# EAGLE schematic ModulePlatform (EAGLE 7.7.0)

## Sheet 1 of 4
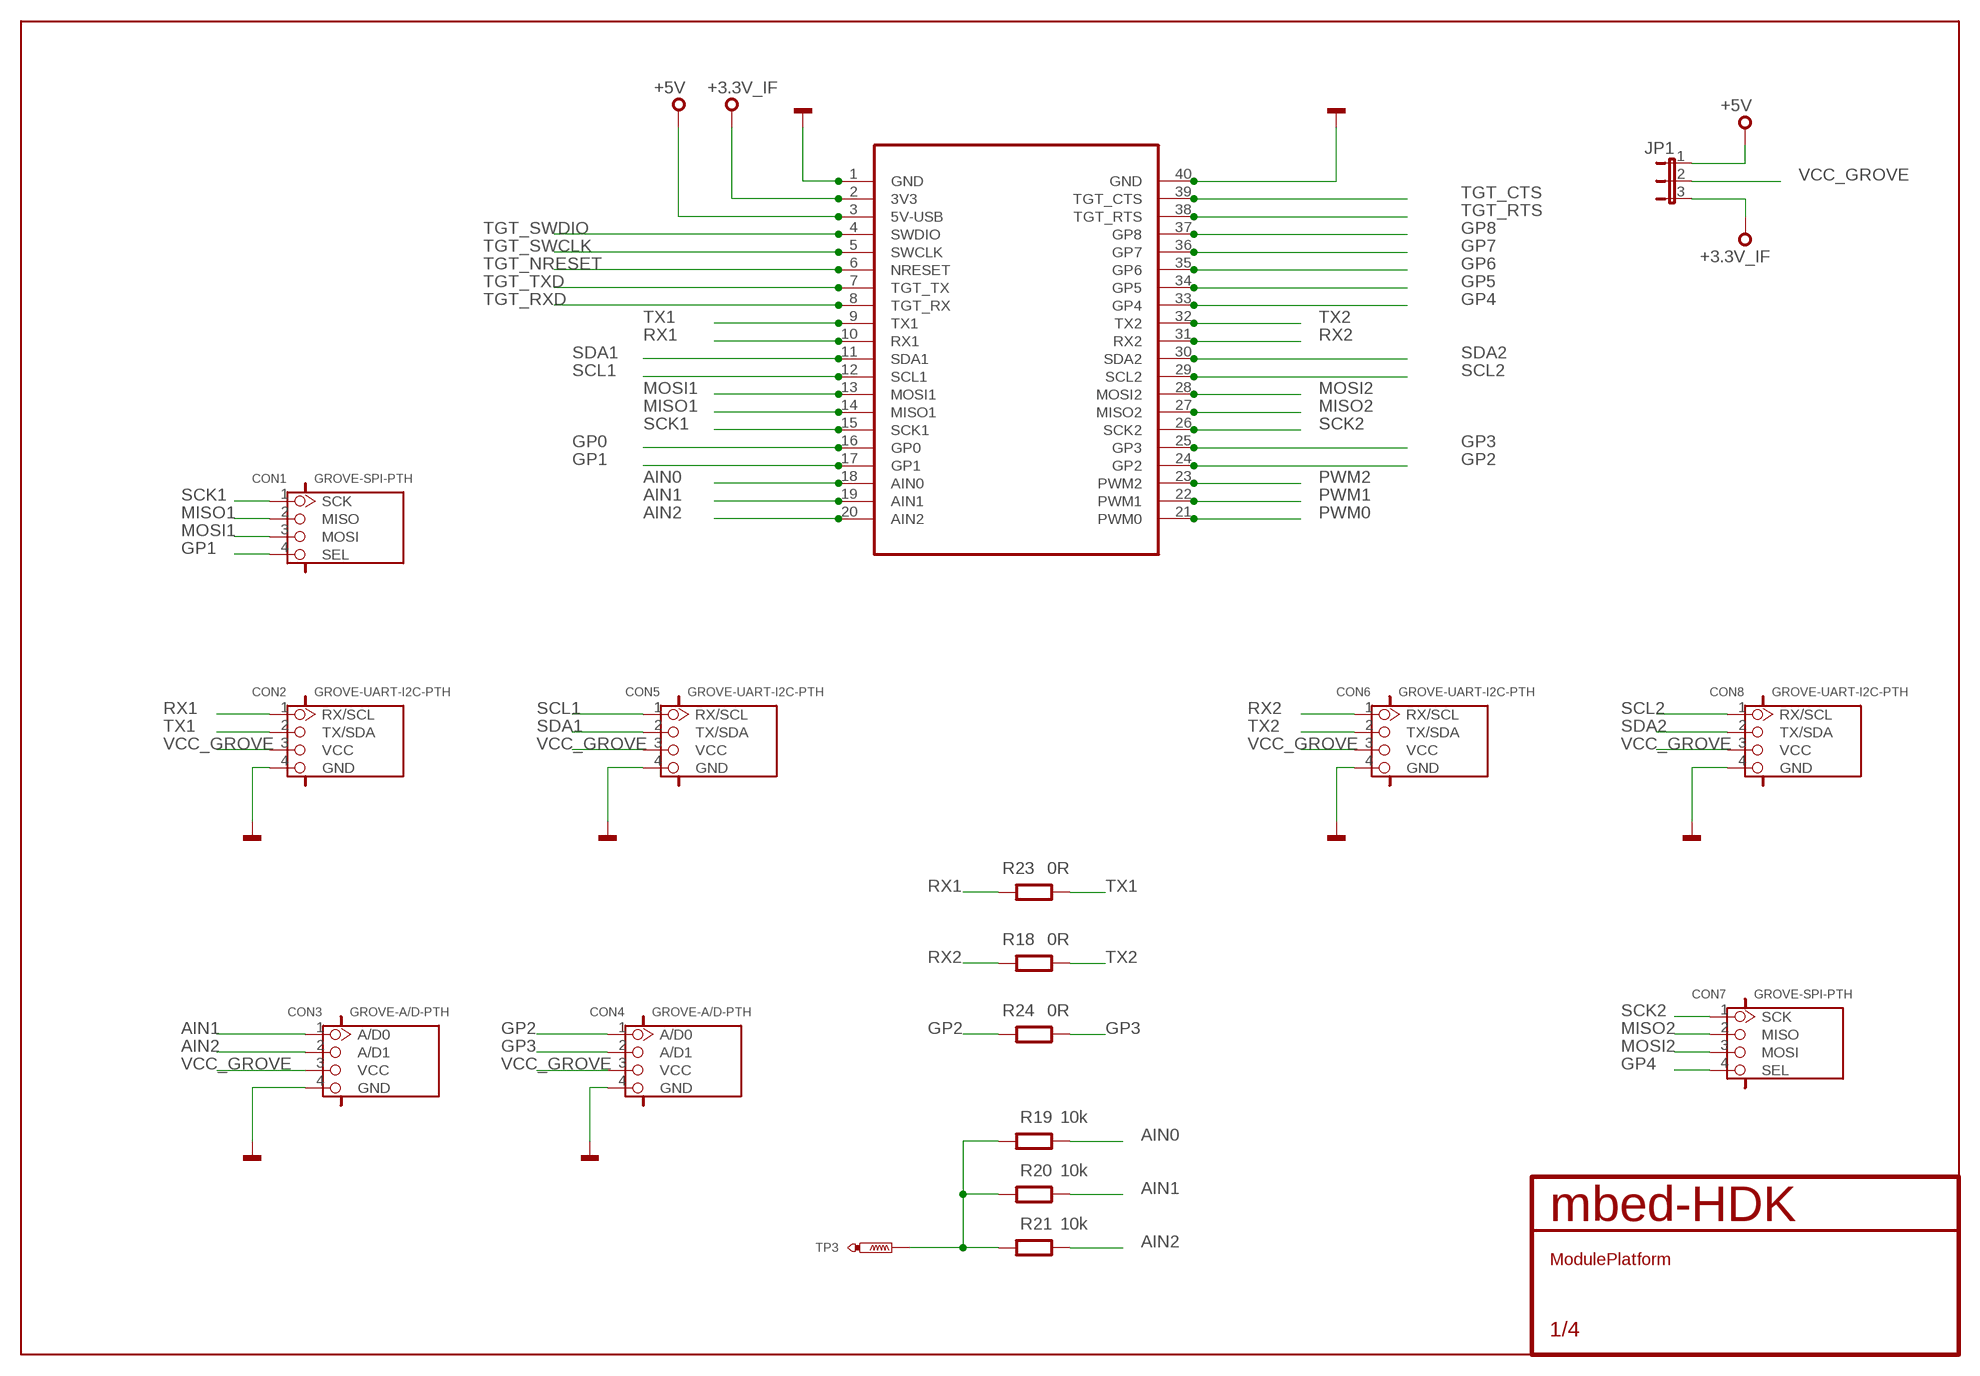
[diagram p0: schematic, sheet 1]

### Parts
CON1  GROVE-SPI-PTH  [HW4-2.0]
CON2  GROVE-UART-I2C-PTH  [HW4-2.0]
CON3  GROVE-A/D-PTH  [HW4-2.0]
CON4  GROVE-A/D-PTH  [HW4-2.0]
CON5  GROVE-UART-I2C-PTH  [HW4-2.0]
CON6  GROVE-UART-I2C-PTH  [HW4-2.0]
CON7  GROVE-SPI-PTH  [HW4-2.0]
CON8  GROVE-UART-I2C-PTH  [HW4-2.0]
JP1  JP2E  [JP2]
R18  0R  R0603  [0603@1]
R19  10k  R0603  [0603@1]
R20  10k  R0603  [0603@1]
R21  10k  R0603  [0603@1]
R23  0R  R0603  [0603@1]
R24  0R  R0603  [0603@1]
SKT1  MODULE_SOCKET  [MODULE_SOCKET]
TP3  TEST-POINT-50R-PTH  [TP50-PTH]

### Nets
+3.3V_IF: JP1.3 SKT1.2(3V3) SKT1.P$42 ; also sheet 2,3,4
+5V: JP1.1 SKT1.3(5V-USB) SKT1.P$43 ; also sheet 2
AIN0: R19.1 SKT1.18(AIN0) SKT1.P$58 ; also sheet 4
AIN1: CON3.1(A/D0) R20.1 SKT1.19(AIN1) SKT1.P$59
AIN2: CON3.2(A/D1) R21.1 SKT1.20(AIN2) SKT1.P$60
GND: CON2.4(GND) CON3.4(GND) CON4.4(GND) CON5.4(GND) CON6.4(GND) CON8.4(GND) SKT1.1(GND) SKT1.40(GND) SKT1.P$41 SKT1.P$80 ; also sheet 2,3,4
GP0: SKT1.16(GP0) SKT1.P$56 ; also sheet 4
GP1: CON1.4(SEL) SKT1.17(GP1) SKT1.P$57
GP2: CON4.1(A/D0) R24.2 SKT1.24(GP2) SKT1.P$64 ; also sheet 4
GP3: CON4.2(A/D1) R24.1 SKT1.25(GP3) SKT1.P$65
GP4: CON7.4(SEL) SKT1.33(GP4) SKT1.P$73
GP5: SKT1.34(GP5) SKT1.P$74 ; also sheet 4
GP6: SKT1.35(GP6) SKT1.P$75 ; also sheet 4
GP7: SKT1.36(GP7) SKT1.P$76 ; also sheet 4
GP8: SKT1.37(GP8) SKT1.P$77
MISO1: CON1.2(MISO) SKT1.14(MISO1) SKT1.P$54 ; also sheet 4
MISO2: CON7.2(MISO) SKT1.27(MISO2) SKT1.P$67
MOSI1: CON1.3(MOSI) SKT1.13(MOSI1) SKT1.P$53 ; also sheet 4
MOSI2: CON7.3(MOSI) SKT1.28(MOSI2) SKT1.P$68
N$24: R19.2 R20.2 R21.2 TP3.TP
PWM0: SKT1.21(PWM0) SKT1.P$61 ; also sheet 4
PWM1: SKT1.22(PWM1) SKT1.P$62 ; also sheet 4
PWM2: SKT1.23(PWM2) SKT1.P$63 ; also sheet 4
RX1: CON2.1(RX/SCL) R23.2 SKT1.10(RX1) SKT1.P$50
RX2: CON6.1(RX/SCL) R18.2 SKT1.31(RX2) SKT1.P$71
SCK1: CON1.1(SCK) SKT1.15(SCK1) SKT1.P$55 ; also sheet 4
SCK2: CON7.1(SCK) SKT1.26(SCK2) SKT1.P$66
SCL1: CON5.1(RX/SCL) SKT1.12(SCL1) SKT1.P$52 ; also sheet 4
SCL2: CON8.1(RX/SCL) SKT1.29(SCL2) SKT1.P$69 ; also sheet 4
SDA1: CON5.2(TX/SDA) SKT1.11(SDA1) SKT1.P$51 ; also sheet 4
SDA2: CON8.2(TX/SDA) SKT1.30(SDA2) SKT1.P$70 ; also sheet 4
TGT_CTS: SKT1.39(TGT_CTS) SKT1.P$79 ; also sheet 3
TGT_NRESET: SKT1.6(NRESET) SKT1.P$46 ; also sheet 3
TGT_RTS: SKT1.38(TGT_RTS) SKT1.P$78 ; also sheet 3
TGT_RXD: SKT1.8(TGT_RX) SKT1.P$48 ; also sheet 3
TGT_SWCLK: SKT1.5(SWCLK) SKT1.P$45 ; also sheet 3
TGT_SWDIO: SKT1.4(SWDIO) SKT1.P$44 ; also sheet 3
TGT_TXD: SKT1.7(TGT_TX) SKT1.P$47 ; also sheet 3
TX1: CON2.2(TX/SDA) R23.1 SKT1.9(TX1) SKT1.P$49
TX2: CON6.2(TX/SDA) R18.1 SKT1.32(TX2) SKT1.P$72
VCC_GROVE: CON2.3(VCC) CON3.3(VCC) CON4.3(VCC) CON5.3(VCC) CON6.3(VCC) CON8.3(VCC) JP1.2

## Sheet 2 of 4
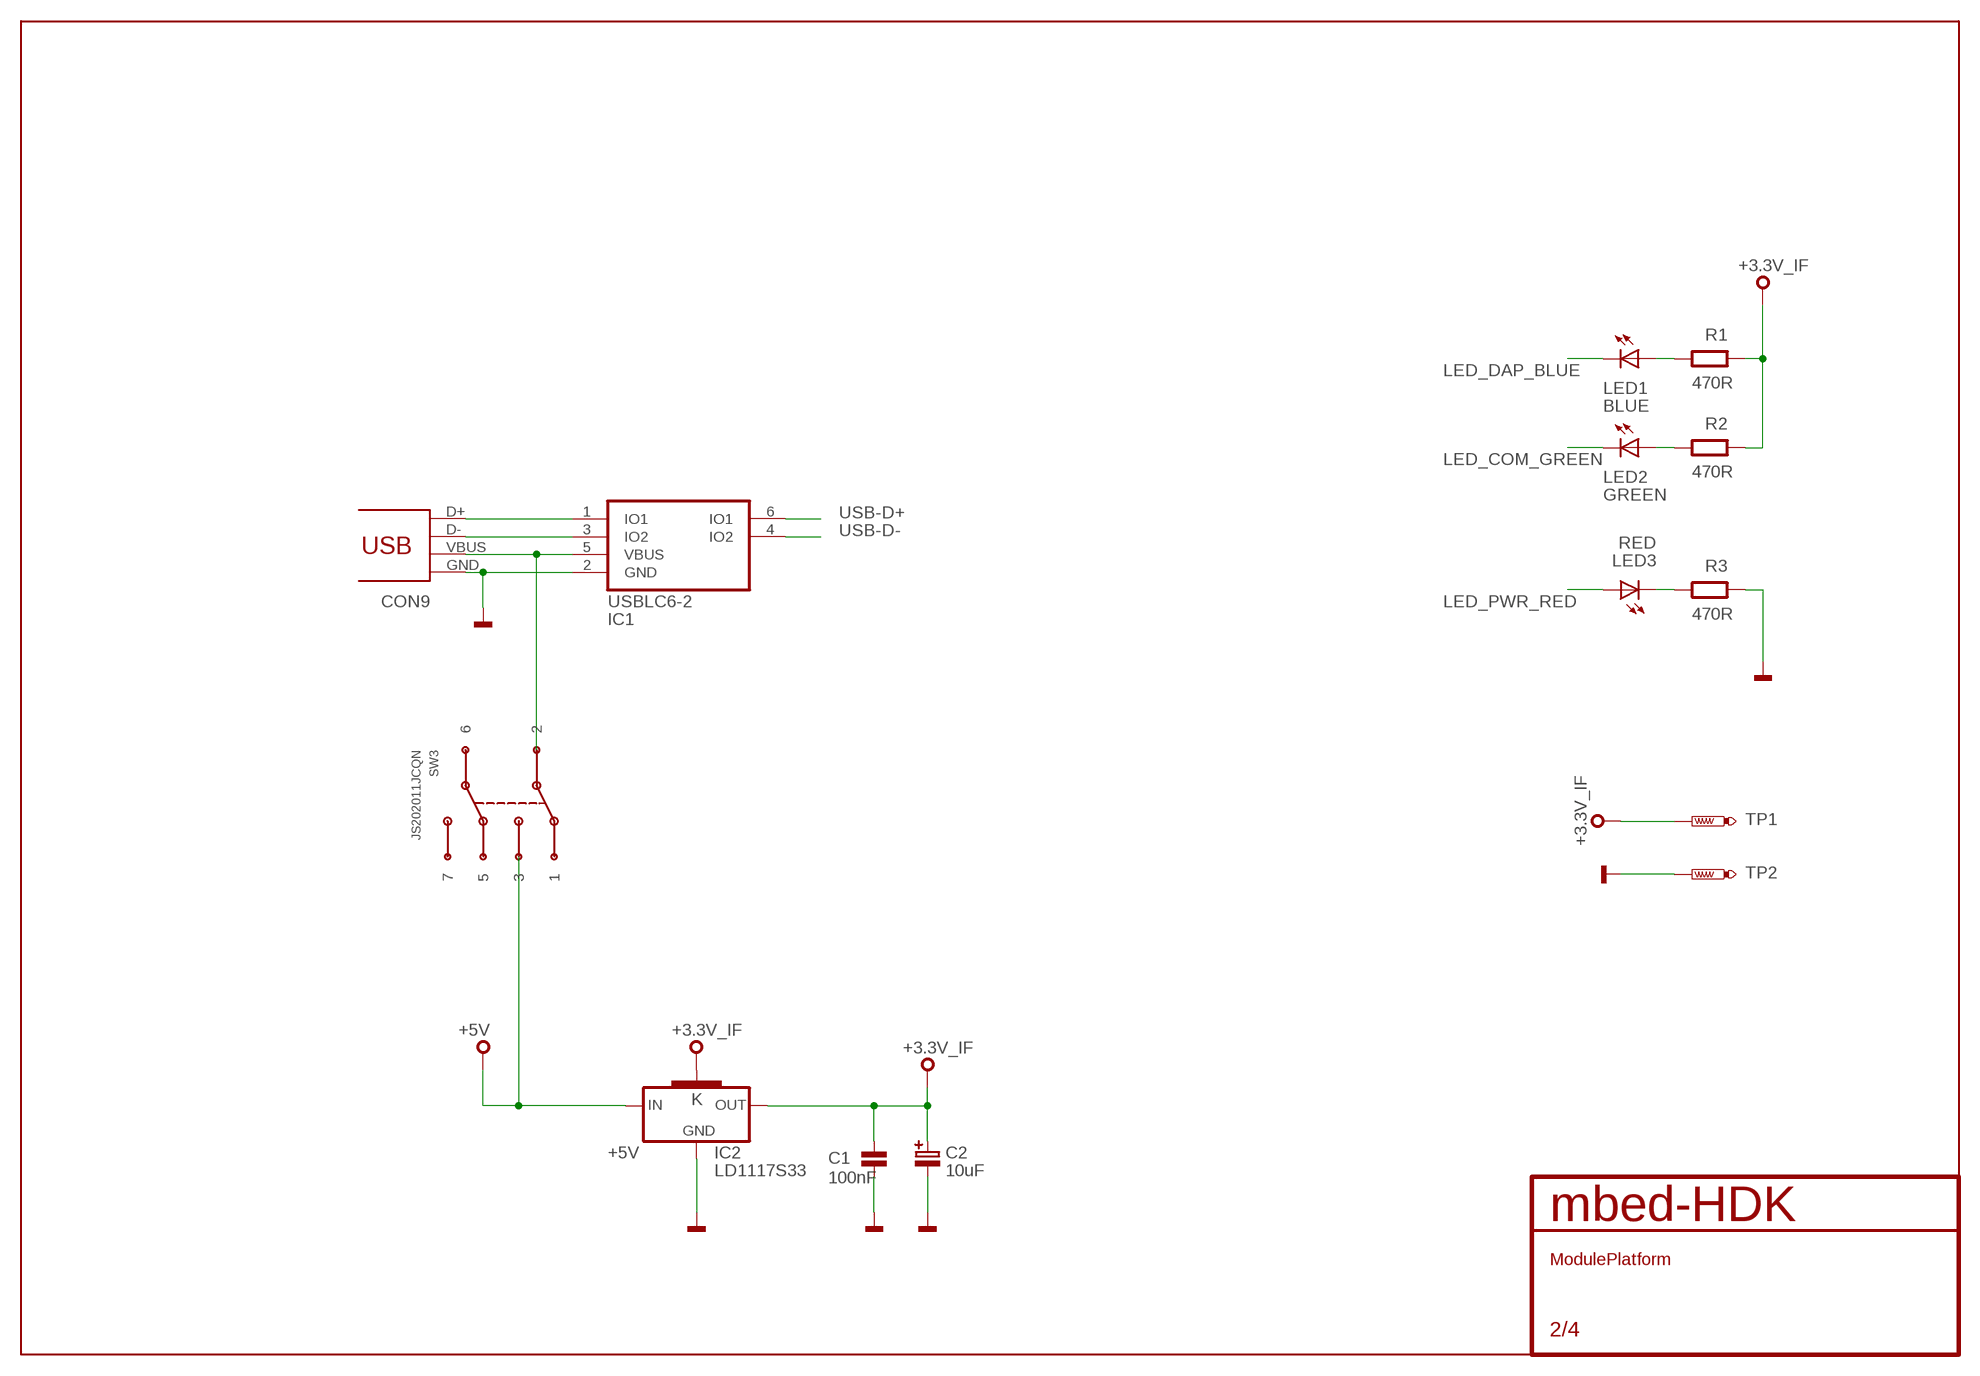
[diagram p1: schematic, sheet 2]

### Parts
C1  100nF  C0603  [0603]
C2  10uF  C-POLB  [SMC_B]
CON9  USB_MICROB  [MOLEX-47364-0001]
IC1  USBLC6-2SC6  [SOT23-6L]
IC2  LD1117S33  [SOT223]
LED1  BLUE  LED0603  [CHIPLED_0603]
LED2  GREEN  LED0603  [CHIPLED_0603]
LED3  RED  LED0603  [CHIPLED_0603]
R1  470R  R0603  [0603@1]
R2  470R  R0603  [0603@1]
R3  470R  R0603  [0603@1]
SW3  JS202011JCQN  [JS202011JCQN]
TP1  TEST-POINT-50R-PTH  [TP50-PTH]
TP2  TEST-POINT-50R-PTH  [TP50-PTH]

### Nets
+3.3V_IF: C1.1 C2.+ IC2.2(OUT) IC2.4(K) R1.1 R2.1 TP1.TP ; also sheet 1,3,4
+5V: IC2.3(IN) SW3.3 ; also sheet 1
GND: C1.2 C2.- CON9.GND IC1.2(GND) IC2.1(GND) R3.1 TP2.TP ; also sheet 1,3,4
LED_COM_GREEN: LED2.C ; also sheet 3
LED_DAP_BLUE: LED1.C ; also sheet 3
LED_PWR_RED: LED3.A ; also sheet 3
N$1: CON9.D+ IC1.1(IO1)
N$2: CON9.D- IC1.3(IO2)
N$6: LED2.A R2.2
N$9: LED3.C R3.2
N$13: LED1.A R1.2
N$27: CON9.VBUS IC1.5(VBUS) SW3.2
USB-D+: IC1.6(IO1) ; also sheet 3
USB-D-: IC1.4(IO2) ; also sheet 3
Unconnected: SW3.1 SW3.5 SW3.6 SW3.7

## Sheet 3 of 4
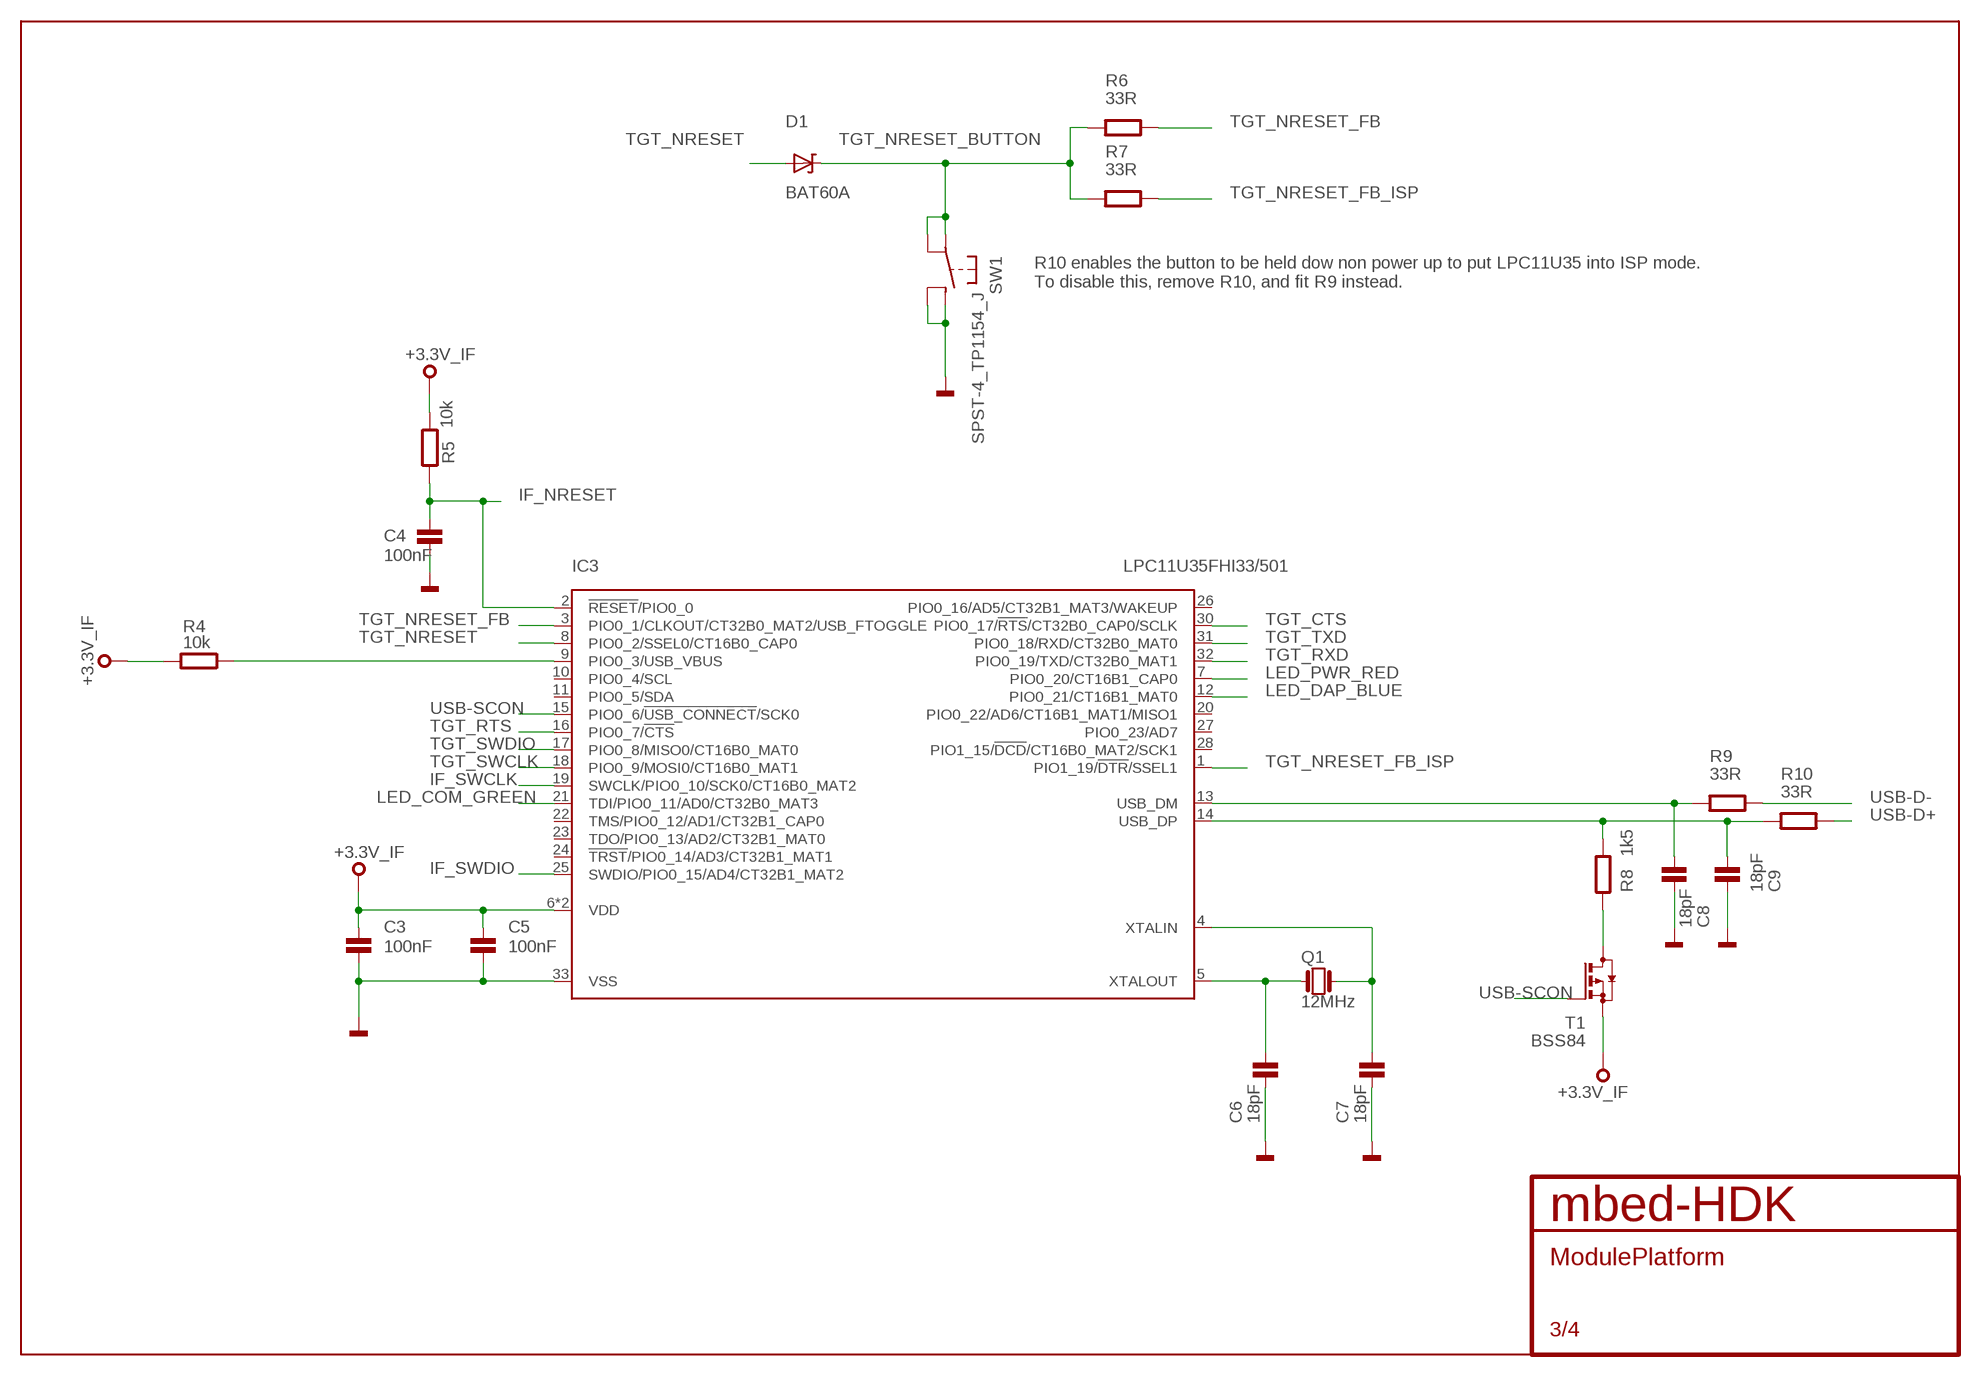
[diagram p2: schematic, sheet 3]

### Parts
C3  100nF  C0603  [0603]
C4  100nF  C0603  [0603]
C5  100nF  C0603  [0603]
C6  18pF  C0603  [0603]
C7  18pF  C0603  [0603]
C8  18pF  C0603  [0603]
C9  18pF  C0603  [0603]
D1  BAT60A  [BAT60A]
IC3  LPC11U35FHI33/501  [SOT617-3]
Q1  12MHz  Q_3.2X2.5  [3.2X.2.5]
R4  10k  R0603  [0603@1]
R5  10k  R0603  [0603@1]
R6  33R  R0603  [0603@1]
R7  33R  R0603  [0603@1]
R8  1k5  R0603  [0603@1]
R9  33R  R0603  [0603@1]
R10  33R  R0603  [0603@1]
SW1  SPST-4_TP1154_J  [TP-1154X]
T1  BSS84  [SOT23]

### Nets
+3.3V_IF: C3.1 C5.1 IC3.6(VDD) IC3.29(VDD) R4.2 R5.2 T1.2(S) ; also sheet 1,2,4
GND: C3.2 C4.2 C5.2 C6.2 C7.2 C8.2 C9.2 IC3.33(VSS) SW1.B1 SW1.B2 ; also sheet 1,2,4
IF_NRESET: C4.1 IC3.2(!RESET!/PIO0_0) R5.1
IF_SWCLK: IC3.19(SWCLK/PIO0_10/SCK0/CT16B0_MAT2)
IF_SWDIO: IC3.25(SWDIO/PIO0_15/AD4/CT32B1_MAT2)
LED_COM_GREEN: IC3.21(TDI/PIO0_11/AD0/CT32B0_MAT3) ; also sheet 2
LED_DAP_BLUE: IC3.12(PIO0_21/CT16B1_MAT0) ; also sheet 2
LED_PWR_RED: IC3.7(PIO0_20/CT16B1_CAP0) ; also sheet 2
N$7: IC3.9(PIO0_3/USB_VBUS) R4.1
N$10: C6.1 IC3.5(XTALOUT) Q1.P$1
N$14: C7.1 IC3.4(XTALIN) Q1.P$3
N$23: R8.1 T1.3(D)
TGT_CTS: IC3.30(PIO0_17/!RTS!/CT32B0_CAP0/SCLK) ; also sheet 1
TGT_NRESET: D1.A IC3.8(PIO0_2/SSEL0/CT16B0_CAP0) ; also sheet 1
TGT_NRESET_BUTTON: D1.K R6.2 R7.2 SW1.A1 SW1.A2
TGT_NRESET_FB: IC3.3(PIO0_1/CLKOUT/CT32B0_MAT2/USB_FTOGGLE) R6.1
TGT_NRESET_FB_ISP: IC3.1(PIO1_19/!DTR!/SSEL1) R7.1
TGT_RTS: IC3.16(PIO0_7/!CTS!) ; also sheet 1
TGT_RXD: IC3.32(PIO0_19/TXD/CT32B0_MAT1) ; also sheet 1
TGT_SWCLK: IC3.18(PIO0_9/MOSI0/CT16B0_MAT1) ; also sheet 1
TGT_SWDIO: IC3.17(PIO0_8/MISO0/CT16B0_MAT0) ; also sheet 1
TGT_TXD: IC3.31(PIO0_18/RXD/CT32B0_MAT0) ; also sheet 1
USB-D+: R10.1 ; also sheet 2
USB-D-: R9.1 ; also sheet 2
USB-SCON: IC3.15(PIO0_6/!USB_CONNECT!/SCK0) T1.1(G)
USB_DM: C8.1 IC3.13(USB_DM) R9.2
USB_DP: C9.1 IC3.14(USB_DP) R8.2 R10.2
Unconnected: IC3.10(PIO0_4/SCL) IC3.11(PIO0_5/SDA) IC3.20(PIO0_22/AD6/CT16B1_MAT1/MISO1) IC3.22(TMS/PIO0_12/AD1/CT32B1_CAP0) IC3.23(TDO/PIO0_13/AD2/CT32B1_MAT0) IC3.24(!TRST!/PIO0_14/AD3/CT32B1_MAT1) IC3.26(PIO0_16/AD5/CT32B1_MAT3/WAKEUP) IC3.27(PIO0_23/AD7) IC3.28(PIO1_15/!DCD!/CT16B0_MAT2/SCK1)

### Notes on the sheet
- R10 enables the button to be held dow non power up to put LPC11U35 into ISP mode.
  To disable this, remove R10, and fit R9 instead.

## Sheet 4 of 4
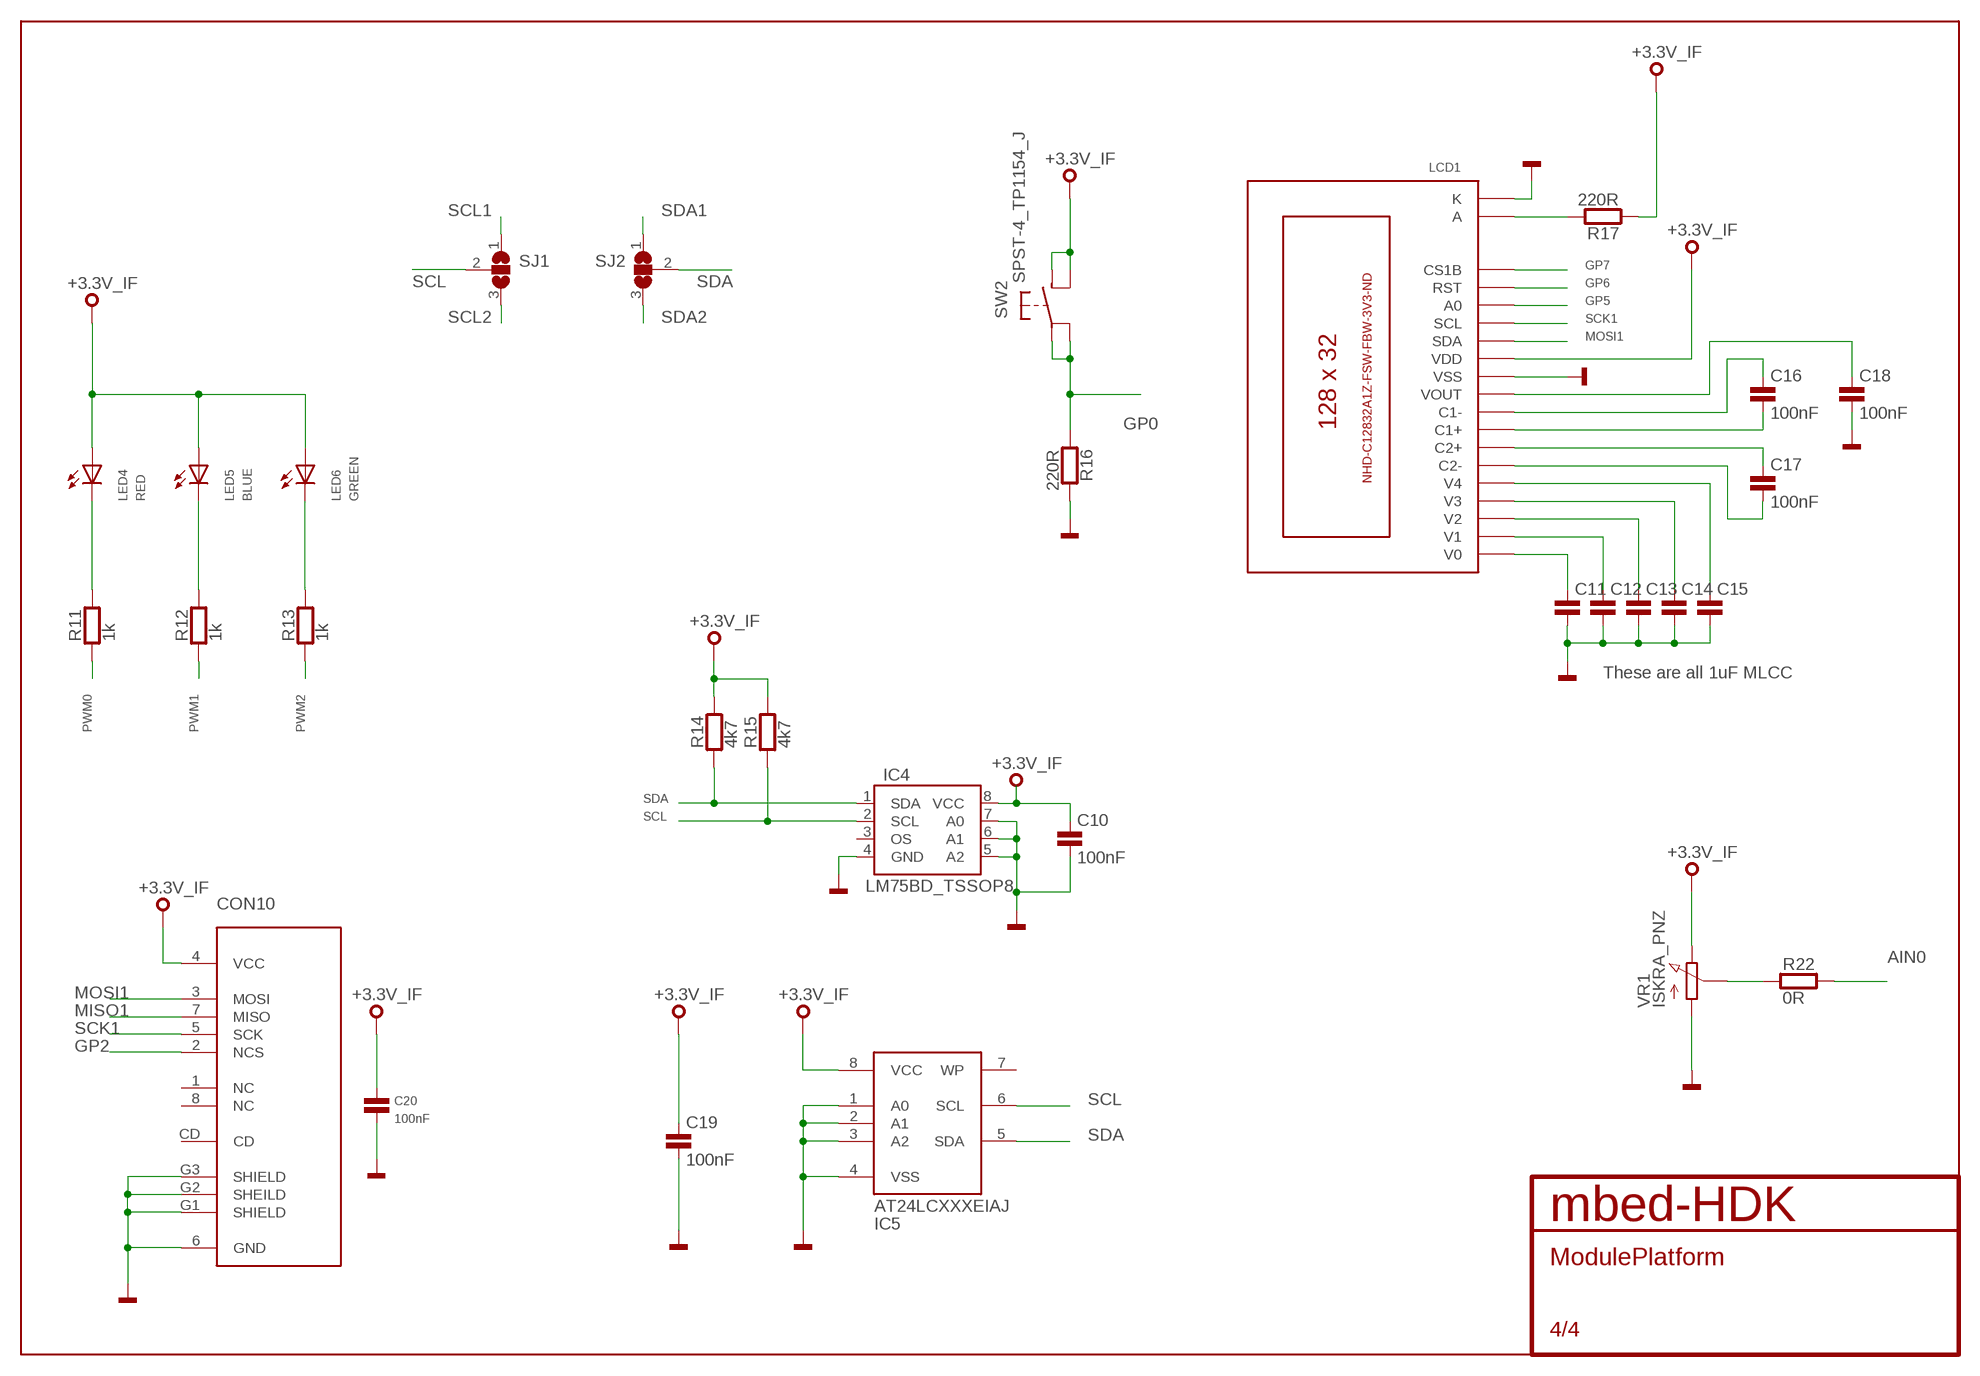
[diagram p3: schematic, sheet 4]

### Parts
C10  100nF  C0603  [0603]
C11  100nF  C0603  [0603]
C12  100nF  C0603  [0603]
C13  100nF  C0603  [0603]
C14  100nF  C0603  [0603]
C15  100nF  C0603  [0603]
C16  100nF  C0603  [0603]
C17  100nF  C0603  [0603]
C18  100nF  C0603  [0603]
C19  100nF  C0603  [0603]
C20  100nF  C0603  [0603]
CON10  MICRO-SD  [AMPHENOL-101-00660-68-6]
IC4  LM75BD_TSSOP8  [TSSOP8]
IC5  AT24LCXXXEIAJ  [SO08-EIAJ]
LCD1  C12832A1Z  [C12832A1Z]
LED4  RED  LED0603  [CHIPLED_0603]
LED5  BLUE  LED0603  [CHIPLED_0603]
LED6  GREEN  LED0603  [CHIPLED_0603]
R11  1k  R0603  [0603]
R12  1k  R0603  [0603]
R13  1k  R0603  [0603]
R14  4k7  R0603  [0603]
R15  4k7  R0603  [0603]
R16  220R  R0603  [0603]
R17  220R  R0603  [0603]
R22  0R  R0603  [0603]
SJ1  SJ2W  [SJ_2]
SJ2  SJ2W  [SJ_2]
SW2  SPST-4_TP1154_J  [TP-1154X]
VR1  ISKRA_PNZ  [CA14V]

### Nets
+3.3V_IF: C10.1 C19.1 C20.1 CON10.4(VCC) IC4.8(VCC) IC5.8(VCC) LCD1.P$12(VDD) LED4.A LED5.A LED6.A R14.2 R15.2 R17.1 SW2.B1 SW2.B2 VR1.P$3(E) ; also sheet 1,2,3
AIN0: R22.2 ; also sheet 1
GND: C10.2 C11.2 C12.2 C13.2 C14.2 C15.2 C18.2 C19.2 C20.2 CON10.6(GND) CON10.G1(SHIELD) CON10.G2(SHEILD) CON10.G3(SHIELD) IC4.4(GND) IC4.5(A2) IC4.6(A1) IC4.7(A0) IC5.1(A0) IC5.2(A1) IC5.3(A2) IC5.4(VSS) LCD1.K LCD1.P$11(VSS) R16.2 VR1.P$1(A) ; also sheet 1,2,3
GP0: R16.1 SW2.A1 SW2.A2 ; also sheet 1
GP2: CON10.2(NCS) ; also sheet 1
GP5: LCD1.P$15(A0) ; also sheet 1
GP6: LCD1.P$16(RST) ; also sheet 1
GP7: LCD1.P$17(CS1B) ; also sheet 1
MISO1: CON10.7(MISO) ; also sheet 1
MOSI1: CON10.3(MOSI) LCD1.P$13(SDA) ; also sheet 1
N$3: C16.1 LCD1.P$9(C1-)
N$4: C17.1 LCD1.P$7(C2+)
N$5: C17.2 LCD1.P$6(C2-)
N$8: C16.2 LCD1.P$8(C1+)
N$11: C11.1 LCD1.P$1(V0)
N$12: C12.1 LCD1.P$2(V1)
N$15: C13.1 LCD1.P$3(V2)
N$16: C14.1 LCD1.P$4(V3)
N$17: C15.1 LCD1.P$5(V4)
N$18: C18.1 LCD1.P$10(VOUT)
N$19: LED4.C R11.2
N$20: LED6.C R13.2
N$21: LED5.C R12.2
N$22: LCD1.A R17.2
N$25: R22.1 VR1.P$2(S)
PWM0: R11.1 ; also sheet 1
PWM1: R12.1 ; also sheet 1
PWM2: R13.1 ; also sheet 1
SCK1: CON10.5(SCK) LCD1.P$14(SCL) ; also sheet 1
SCL: IC4.2(SCL) IC5.6(SCL) R15.1 SJ1.2
SCL1: SJ1.1 ; also sheet 1
SCL2: SJ1.3 ; also sheet 1
SDA: IC4.1(SDA) IC5.5(SDA) R14.1 SJ2.2
SDA1: SJ2.1 ; also sheet 1
SDA2: SJ2.3 ; also sheet 1
Unconnected: CON10.1(NC) CON10.8(NC) CON10.CD IC4.3(OS) IC5.7(WP)

### Notes on the sheet
- These are all 1uF MLCC

## Library data of the parts
C1 C3-C9 C20 = mbed-HDK:C: Capacitor
C2 = mbed-HDK:C-POL: Polarised capacitor
C10-C19 = mbed-rlcq:C
CON1 CON7 = Treadstone:GROVE-SPI-PTH
CON2 CON5 CON6 CON8 = Treadstone:GROVE-UART-I2C-PTH
CON3 CON4 = Treadstone:GROVE-A/D-PTH
CON9 = mbed-HDK:USB: USB Connectors
CON10 = mbed-HDK:MICRO-SD
D1 = mbed-HDK:BAT60A: Schottky Diode
IC1 = mbed-HDK:USBLC6-2
IC2 = mbed-HDK:LD1117S33: VOLTAGE REGULATOR SMD 3,3V
IC3 = mbed-HDK:LPC11U35FHI33: 32-bit ARM Cortex-M0 microcontroller; up to 128 kB flash; up to 12 kB SRAM and 4 kB EEPROM; USB device; USART The LPC11U3x are a ARM Cortex-M0 based, low-cost 32-bit MCU family, designed for 8/16-bit microcontroller applications, offering performance, low power, simple instruction set and memory addressing together with reduced code size compared to existing 8/16-bit architectures. The LPC11U3x operate at CPU frequencies of up to 50 MHz. Equipped with a highly flexible and configurable Full Speed USB 2.0 device controller, the LPC11U3x brings unparalleled design flexibility and seamless integration to today’s demanding connectivity solutions. The peripheral complement of the LPC11U3x includes up to 128 kB of flash memory, up to 12 kB of SRAM data memory and 4 kB EEPROM, one Fast-mode Plus I 2 C-bus interface, one RS-485/EIA-485 USART with support for synchronous mode and smart card interface, two SSP interfaces, four general purpose counter/timers, a 10-bit ADC, and up to 54 general purpose I/O pins. AAL Eindhoven MK; FLASH: 64kB; GPIO: 26; SRAM: 12kB
IC4 = LabBoard:LM75BD
IC5 = mbed-HDK:AT24LCXXX: I2C EEPROM, 24LC family
JP1 = Treadstone:JP2E: JUMPER
LCD1 = LabBoard:C12832A1Z
LED1-LED6 = mbed-HDK:LED: SMD LED
Q1 = mbed-HDK:Q
R1-R10 R18-R21 R23 R24 = mbed-HDK:R
R11-R17 R22 = mbed-rlcq:R
SJ1 SJ2 = jumper:SJ2W: SMD solder JUMPER
SKT1 = Treadstone:MODULE_SOCKET
SW1 SW2 = mbed-HDK:SPST-4
SW3 = mbed-HDK-Switch:JS202011JCQN: SLIDE TOGGLE SWITCH VERTICAL (DPDT); MF: C&K Components; MFN: JS202011JCQN; OC-DIGIKEY: CKN10723CT-ND; OC-MOUSER: 611-JS202011JCQN
T1 = mbed-HDK:BSS84: P-CHANNEL MOS FET
TP1-TP3 = mbed-HDK:TEST-POINT
VR1 = LabBoard:ISKRA_PNZ